# EAGLE design rfm69 (EAGLE 6.5.0)
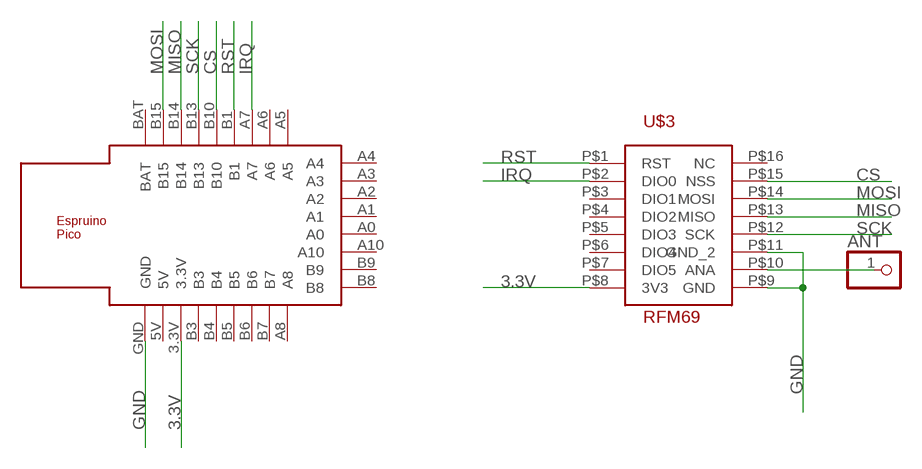
[diagram p0: schematic, sheet 1]

## Parts
ANT  PINHD-1X1  [1X01]
U$1  ESPRUINO_PICO_SMDONLY  [ESPRUINO_PICO_SMDONLY]
U$3  RFM69  [RFM69]

## Nets
3.3V: U$1.3.3V U$3.P$8(3V3)
CS: U$1.B10 U$3.P$15(NSS)
GND: U$1.GND U$3.P$9(GND) U$3.P$11(GND_2)
IRQ: U$1.A7 U$3.P$2(DIO0)
MISO: U$1.B14 U$3.P$13(MISO)
MOSI: U$1.B15 U$3.P$14(MOSI)
N$1: ANT.1 U$3.P$10(ANA)
RST: U$1.B1 U$3.P$1(RST)
SCK: U$1.B13 U$3.P$12(SCK)
Unconnected: U$1.5V U$1.A0 U$1.A1 U$1.A2 U$1.A3 U$1.A4 U$1.A5 U$1.A6 U$1.A8 U$1.A10 U$1.B3 U$1.B4 U$1.B5 U$1.B6 U$1.B7 U$1.B8 U$1.B9 U$1.BAT U$3.P$3(DIO1) U$3.P$4(DIO2) U$3.P$5(DIO3) U$3.P$6(DIO4) U$3.P$7(DIO5) U$3.P$16(NC)

## Library data of the parts
ANT = pinhead:PINHD-1X1: PIN HEADER
U$1 = espruino_pico:ESPRUINO_PICO_SMDONLY
U$3 = RFM69:RFM69

## Net classes
0 default: width 0.305 mm

## Board
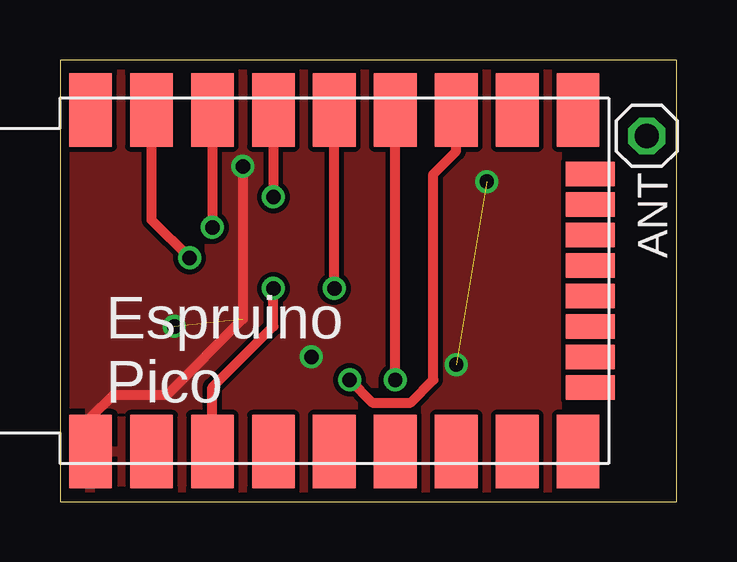
[diagram p1: board, top side]
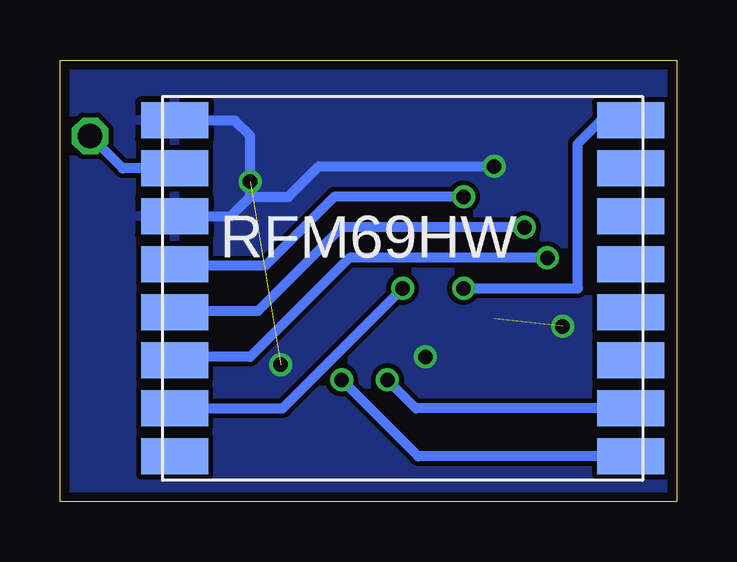
[diagram p2: board, bottom side, seen from below]

Size 25.7 x 18.41 mm. Coordinates in mm from the lower left corner, seen from the top.
Outline: 0,0 25.7,0 25.7,18.41 0,18.41 0,0
Copper layers (1*16): Top 0.0356mm / dielectric 1.5011mm / Bottom 0.0356mm
Design rules "oshpark *": minimum track width 10mil, minimum drill 13mil, track to track 8mil, track to pad 6mil, pad to pad 6mil, via to via 6mil, smd to smd 6mil, copper to edge 15mil, drill to drill 6mil, minimum pad ring 7mil, minimum via ring 7mil, stop-mask expansion 4mil, vias tented up to drill 30mil, thermal gap 10mil

### Footprints (pad centres in the part's own frame; a part is rotated, then mirrored left to right if it is on the bottom)
1X01 = drill 1.016 octagon: 1 0,0
ESPRUINO_PICO_SMDONLY = smd 1.778 x 3.048: 3.3V -8.89,-7.112; 5V -11.43,-7.112; A5 6.35,7.112; A6 3.81,7.112; A7 1.27,7.112; A8 6.35,-7.112; B1 -1.27,7.112; B3 -6.35,-7.112; B4 -3.81,-7.112; B5 -1.27,-7.112; B6 1.27,-7.112; B7 3.81,-7.112; B10 -3.81,7.112; B13 -6.35,7.112; B14 -8.89,7.112; B15 -11.43,7.112; BAT -13.97,7.112; GND -13.97,-7.112 | smd 2.032 x 1.016: A0 6.858,-0.635; A1 6.858,0.635; A2 6.858,1.905; A3 6.858,3.175; A4 6.858,4.445; A10 6.858,-1.905; B8 6.858,-4.445; B9 6.858,-3.175
RFM69 = smd 2.8 x 1.5: P$1 -9.5,7; P$2 -9.5,5; P$3 -9.5,3; P$4 -9.5,1; P$5 -9.5,-1; P$6 -9.5,-3; P$7 -9.5,-5; P$8 -9.5,-7; P$9 9.5,-7; P$10 9.5,-5; P$11 9.5,-3; P$12 9.5,-1; P$13 9.5,1; P$14 9.5,3; P$15 9.5,5; P$16 9.5,7

### Placement (x,y rotation side)
ANT  24.45,15.24 0 top
U$1  15.24,9.21 0 top
U$3  11.43,8.89 180 bottom

### Tracks (layer width: path | path; a pad name or v marks a point on that pad's centre or on a via)
3.3V  (via drill 0.6)
  Top 0.406: U$1.3.3V 6.35,4.76 8.89,7.3 v8.89,8.89
  Bottom 0.406: v8.89,8.89 4.13,8.89 4.13,14.92 3.17,15.88 1.95,15.88 U$3.P$8
CS  (via drill 0.6)
  Top 0.406: v11.43,8.89 U$1.B10
  Bottom 0.406: U$3.P$15 16.43,3.89 v11.43,8.89
GND  (via drill 0.6)  (2 unrouted)
  Top 0.406: v7.62,13.97 7.62,7.62 4.45,4.45 2.22,4.45 1.27,3.49 U$1.GND
  Bottom 0.406: U$3.P$11 18.59,11.89 17.78,12.7 | 17.78,12.7 17.78,15.24 18.41,15.88 20.91,15.88 U$3.P$9 | 17.78,12.7 16.19,12.7 14.92,13.97 v7.62,13.97
  other vias: 17.78,13.34 16.51,5.71 10.48,6.03 4.76,7.3
  pour Bottom: -0.32,19.37 26.35,19.37 26.35,-0.95 17.78,-0.95 -0.32,-0.64
  pour Top: 0,19.05 26.67,19.05 26.67,-1.27 0,-1.27
IRQ  (via drill 0.6)
  Top 0.406: v12.06,5.08 13.02,4.13 14.61,4.13 15.56,5.08 15.56,13.65 16.51,14.61 U$1.A7
  Bottom 0.406: U$3.P$2 10.88,3.89 v12.06,5.08
MISO  (via drill 0.6)
  Top 0.406: U$1.B14 v6.35,11.43
  Bottom 0.406: v6.35,11.43 13.97,11.43 17.46,7.94 20.88,7.94 U$3.P$13
MOSI  (via drill 0.6)
  Top 0.406: U$1.B15 3.81,11.75 v5.4,10.16
  Bottom 0.406: v5.4,10.16 13.65,10.16 17.78,6.03 20.79,6.03 U$3.P$14
N$1
  Bottom 0.406: U$3.P$10 23.1,13.89 ANT.1
RST  (via drill 0.6)
  Top 0.406: v13.97,5.08 U$1.B1
  Bottom 0.406: U$3.P$1 10.78,1.89 v13.97,5.08
SCK  (via drill 0.6)
  Top 0.406: U$1.B13 v8.89,12.7
  Bottom 0.406: v8.89,12.7 14.29,12.7 17.14,9.84 20.88,9.84 U$3.P$12

### Text on the board
tNames: Espruino / Pico
bNames: RFM69HW